# EAGLE design wifi_ring (EAGLE 9.6.1)
Wifi connection for RITTO 7630 (Intercom)
Assembly variants: Main
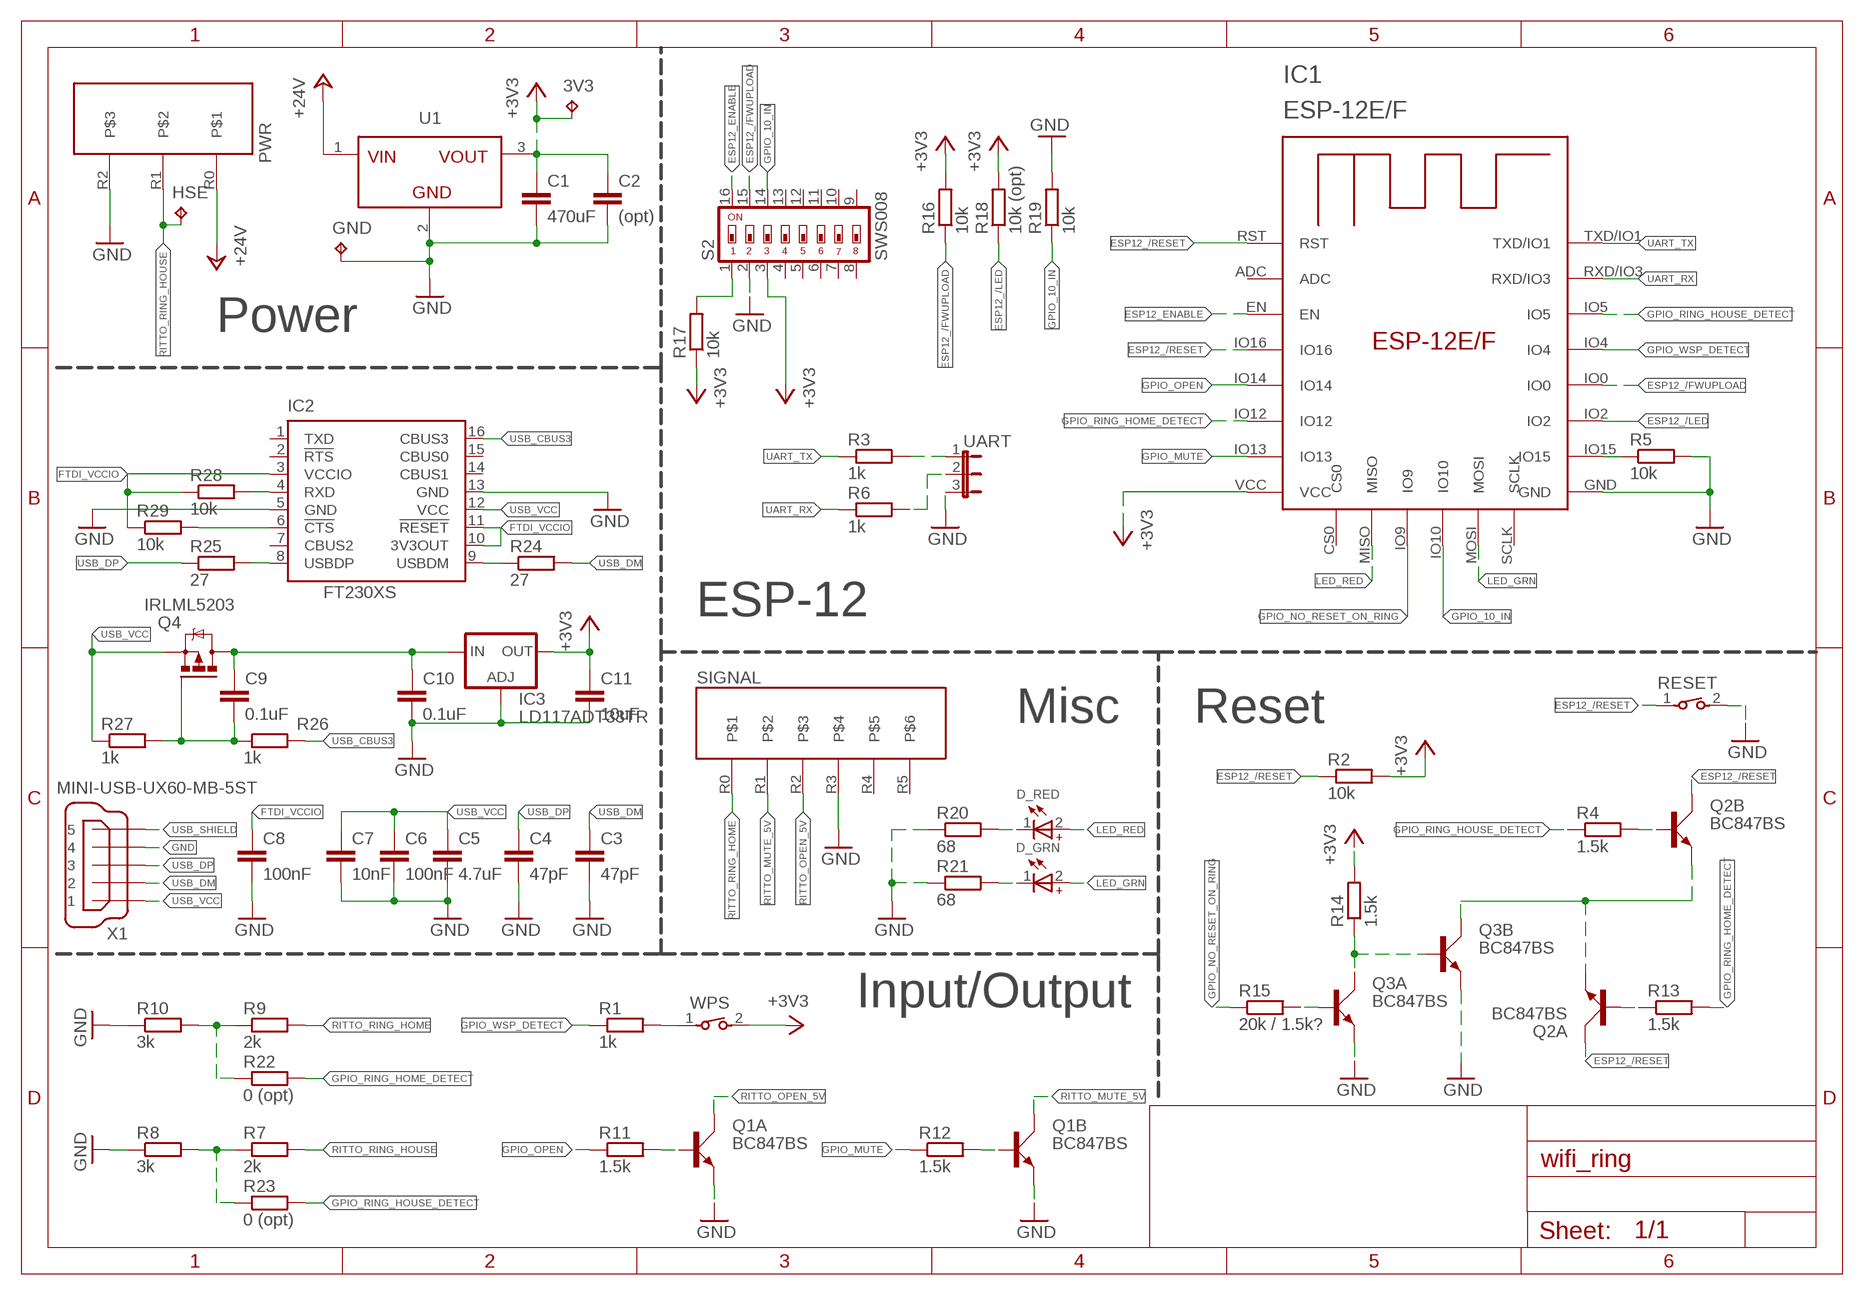
[diagram p0: schematic, sheet 1]

## Parts
3V3  TPTP10SQ  [TP10SQ]
C1  470uF  C-EUC1206  [C1206]
C2  (opt)  C-EUC1206  [C1206]
C3  47pF  C-EUC1206  [C1206]
C4  47pF  C-EUC1206  [C1206]
C5  4.7uF  C-EUC1206  [C1206]
C6  100nF  C-EUC1206  [C1206]
C7  10nF  C-EUC1206  [C1206]
C8  100nF  C-EUC1206  [C1206]
C9  0.1uF  C-EUC1206  [C1206]
C10  0.1uF  C-EUC1206  [C1206]
C11  10uF  C-EUC1206  [C1206]
D_GRN  WL-SMRW_1206_CYL_156120VS75300_NOR  [WL-SMRW_1206_CYL]
D_RED  WL-SMRW_1206_CYL_156120RS75300_NOR  [WL-SMRW_1206_CYL]
GND  TPTP10SQ  [TP10SQ]
HSE  TPTP10SQ  [TP10SQ]
IC1  ESP-12E/F  [ESP-12E]
IC2  FT230XS  [SSOP16]
IC3  LD117ADT33TR  [DPACK]
PWR  RAST_3  [RAST_3]
Q1  BC847BS  [SOT363_PHILIPS]
Q2  BC847BS  [SOT363_PHILIPS]
Q3  BC847BS  [SOT363_PHILIPS]
Q4  IRLML5203  [MICRO3]
R1  1k  R-EU_R1206  [R1206]
R2  10k  R-EU_R1206  [R1206]
R3  1k  R-EU_R1206  [R1206]
R4  1.5k  R-EU_R1206  [R1206]
R5  10k  R-EU_R1206  [R1206]
R6  1k  R-EU_R1206  [R1206]
R7  2k  R-EU_R1206  [R1206]
R8  3k  R-EU_R1206  [R1206]
R9  2k  R-EU_R1206  [R1206]
R10  3k  R-EU_R1206  [R1206]
R11  1.5k  R-EU_R1206  [R1206]
R12  1.5k  R-EU_R1206  [R1206]
R13  1.5k  R-EU_R1206  [R1206]
R14  1.5k  R-EU_R1206  [R1206]
R15  20k / 1.5k?  R-EU_R1206  [R1206]
R16  10k  R-EU_R1206  [R1206]
R17  10k  R-EU_R1206  [R1206]
R18  10k (opt)  R-EU_R1206  [R1206]
R19  10k  R-EU_R1206  [R1206]
R20  68  R-EU_R1206  [R1206]
R21  68  R-EU_R1206  [R1206]
R22  0 (opt)  R-EU_R1206  [R1206]
R23  0 (opt)  R-EU_R1206  [R1206]
R24  27  R-EU_R1206  [R1206]
R25  27  R-EU_R1206  [R1206]
R26  1k  R-EU_R1206  [R1206]
R27  1k  R-EU_R1206  [R1206]
R28  10k  R-EU_R1206  [R1206]
R29  10k  R-EU_R1206  [R1206]
RESET  434123025816  [434123025816]
S2  SWS008  [SMS-008]
SIGNAL  RAST_6  [RAST_6]
U1  MAGI³C-FDSM_SIP-3_173950378_17395XX78  [MAGI³C-FDSM_17395XX78]
UART  JP2E  [JP2]
WPS  434123025816  [434123025816]
X1  MINI-USB-UX60-MB-5ST  [UX60-MB-5ST]

## Nets
+3V3: 3V3.TP C1.1 C2.1 C11.1 IC1.VCC IC3.4(OUT) R2.2 R14.2 R16.2 R17.1 R18.2 S2.3 U1.3(VOUT) WPS.2
+24V: PWR.R0 U1.1(VIN)
ESP12_/FWUPLOAD: IC1.IO0 R16.1 S2.15
ESP12_/LED: IC1.IO2 R18.1
ESP12_/RESET: IC1.IO16 IC1.RST Q2.3(B:C) Q2.6(A:C) R2.1 RESET.1
ESP12_ENABLE: IC1.EN S2.16
FTDI_VCCIO: C8.1 IC2.3(VCCIO) IC2.10(3V3OUT) IC2.11(!RESET) R28.1 R29.1
GND: C1.2 C2.2 C3.2 C4.2 C5.2 C6.2 C7.2 C8.2 C10.2 C11.2 GND.TP IC1.GND IC2.5(GND) IC2.13(GND) IC3.1(ADJ) PWR.R2 Q1.1(A:E) Q1.4(B:E) Q3.1(A:E) Q3.4(B:E) R5.2 R8.1 R10.1 R19.2 R20.1 R21.1 RESET.2 S2.2 SIGNAL.R3 U1.2(GND) UART.3 X1.4
GPIO_10_IN: IC1.IO10 R19.1 S2.14
GPIO_MUTE: IC1.IO13 R12.1
GPIO_NO_RESET_ON_RING: IC1.IO9 R15.1
GPIO_OPEN: IC1.IO14 R11.1
GPIO_RING_HOME_DETECT: IC1.IO12 R13.2 R22.2
GPIO_RING_HOUSE_DETECT: IC1.IO5 R4.1 R23.2
GPIO_WSP_DETECT: IC1.IO4 R1.1
LED_GRN: D_GRN.2(+) IC1.MOSI
LED_RED: D_RED.2(+) IC1.MISO
N$1: R3.2 UART.1
N$2: R6.2 UART.2
N$3: IC1.IO15 R5.1
N$4: R1.2 WPS.1
N$5: R7.1 R8.2 R23.1
N$6: R9.1 R10.2 R22.1
N$7: R17.2 S2.1
N$8: Q2.5(B:B) R4.2
N$9: Q2.2(A:B) R13.1
N$10: Q1.2(A:B) R11.2
N$11: Q1.5(B:B) R12.2
N$12: D_RED.1(-) R20.2
N$13: D_GRN.1(-) R21.2
N$14: Q3.5(B:B) Q3.6(A:C) R14.1
N$15: Q3.2(A:B) R15.2
N$16: Q2.1(A:E) Q2.4(B:E) Q3.3(B:C)
N$17: IC2.9(USBDM) R24.1
N$18: C9.2 Q4.1(G) R26.1 R27.2
N$19: IC2.8(USBDP) R25.2
N$20: C9.1 C10.1 IC3.3(IN) Q4.3(D)
N$21: IC2.4(RXD) R28.2
N$22: IC2.6(!CTS) R29.2
RITTO_MUTE_5V: Q1.3(B:C) SIGNAL.R1
RITTO_OPEN_5V: Q1.6(A:C) SIGNAL.R2
RITTO_RING_HOME: R9.2 SIGNAL.R0
RITTO_RING_HOUSE: HSE.TP PWR.R1 R7.2
UART_RX: IC1.RXD/IO3 R6.1
UART_TX: IC1.TXD/IO1 R3.1
USB_CBUS3: IC2.16(CBUS3) R26.2
USB_DM: C3.1 R24.2 X1.2
USB_DP: C4.1 R25.1 X1.3
USB_SHIELD: X1.5
USB_VCC: C5.1 C6.1 C7.1 IC2.12(VCC) Q4.2(S) R27.1 X1.1
Unconnected: IC1.ADC IC1.CS0 IC1.SCLK IC2.1(TXD) IC2.2(!RTS) IC2.7(CBUS2) IC2.14(CBUS1) IC2.15(CBUS0) S2.4 S2.5 S2.6 S2.7 S2.8 S2.9 S2.10 S2.11 S2.12 S2.13 SIGNAL.R4 SIGNAL.R5

## Notes on the sheet
- Power
- ESP-12
- Misc | Reset
- Input/Output

## Library data of the parts
3V3 GND HSE = testpad:TP: Test pad
C1-C11 = rcl:C-EU: CAPACITOR, European symbol; SPICEPREFIX: C
D_GRN = 156120RS75300_Eagle_WL-SMRW_rev20b:WL-SMRW_1206_CYL: WL-SMRW SMD Mono-color Reverse mount Waterclear Characteristics Small size & thin body for space saving Ideal for narrow space applications Wide viewing angle Low power consumption Industry standard footprint Small LED package for exceptional brightness To emit light through a small cut-out hole in PCB Compatible with automatic placement machine Applications Front panels indicators LCD backlighting Keypad backlighting Push button backlighting Symbol and switch backlighting General LED lighting <https://www.we-online.com/catalog/media/o35733v209%20Family_WL-SMRW_neu.jpg> Details see: http://katalog.we-online.de/en/led/WL-SMRW?m Updated By Yingchun,Shan,2020-03-19 2020 (C) Wurth Elektronik; ABSTRAHLWINKEL: 140°; CHIP-TECHNOLOGY: AlInGaP; DATASHEET-URL: https://www.we-online.com/catalog/datasheet/156120VS75300.pdf; EMITTING-COLOR: Bright Green; I-V-TYP: 30mcd; LAMDA-DOM-TYP: 573nm; LAMDA-PEAK-TYP: 575nm; PART-NUMBER: 156120VS75300; V-F-TYP: 2V
D_RED = 156120RS75300_Eagle_WL-SMRW_rev20b:WL-SMRW_1206_CYL: WL-SMRW SMD Mono-color Reverse mount Waterclear Characteristics Small size & thin body for space saving Ideal for narrow space applications Wide viewing angle Low power consumption Industry standard footprint Small LED package for exceptional brightness To emit light through a small cut-out hole in PCB Compatible with automatic placement machine Applications Front panels indicators LCD backlighting Keypad backlighting Push button backlighting Symbol and switch backlighting General LED lighting <https://www.we-online.com/catalog/media/o35733v209%20Family_WL-SMRW_neu.jpg> Details see: http://katalog.we-online.de/en/led/WL-SMRW?m Updated By Yingchun,Shan,2020-03-19 2020 (C) Wurth Elektronik; ABSTRAHLWINKEL: 140°; CHIP-TECHNOLOGY: AlInGaP; DATASHEET-URL: https://www.we-online.com/catalog/datasheet/156120RS75300.pdf; EMITTING-COLOR: Red; I-V-TYP: 60mcd; LAMDA-DOM-TYP: 624nm; LAMDA-PEAK-TYP: 632nm; PART-NUMBER: 156120RS75300; V-F-TYP: 2V
IC1 = esp-12e-f:ESP-12E/F
IC2 = ftdichip:FT230X: USB to BASIC UART IC Auto generated by make-symbol-device-package-bsdl.ulp Rev. 43 Source: Data sheet <http://www.ftdichip.com/Support/Documents/DataSheets/ICs/DS_FT230X.pdf>
IC3 = v-reg:LD117A?*: Low drop fixed and adjustable positive voltage regulators 1 A Source: http://www.st.com/stonline/products/literature/ds/7194/ld1117axx.pdf
PWR = own_rast:RAST_3: RAST connector with 3 pins
Q1-Q3 = transistor-small-signal:BC847BS: NPN general purpose double transistor Source: http://www.farnell.com/datasheets/2466.pdf
Q4 = transistor-power:IRLML5203: HEXFET P-Channel Power MOSFET
R1-R29 = rcl:R-EU_: RESISTOR, European symbol; SPICEPREFIX: R
RESET WPS = 434123025816_Eagle_WS-TASV_rev20a:434123025816: WS-TASV J-Bend SMT Tact Switch 6.0x3.8 mm Material Properties Cover Material : Stainless Steel Properties Actuator Material:LCP Actuator Flammability :UL94 V-0 Rating Actuator Color:Black;White Frame Material: LCP Frame Flammability Rating :UL94 V-0 Frame Color: Black Contact Material :Stainless Steel Contact Plating: Silver Terminal Material: Copper Alloy Terminal Plating: Silver VR 12 V (DC) Contact Resistance Initial:100 mΩ Contact Resistance After Life Test: 1 Ω RISO:100 MΩ Withstanding Voltage:250 V (AC) Washable:No Qty.:3000 Mechanical Properties Stroke :0.25 mm General Information Operating Temperature:-40 up to +85 °C Washable:No Packaging Properties Packaging:Tape and Reel <https://www.we-online.com/catalog/media/o41273v209%20Family_WS-TASV_J-Bend_SMD_6.0x3.8_J-Bend_Tact_Switch_4341x30258x6.jpg> Details see: https://www.we-online.com/catalog/en/TASV_6_0X3_8_SMD_J-BEND/ Updated by yingchun,Shan;2020-02-20 2020(C) Würth Elektronik; DATASHEET-URL: https://www.we-online.com/catalog/datasheet/434123025816.pdf; H: 2.5mm; OPERATION-FORCE: 160g; PART-NUMBER: 434123025816; QTY: 3000
S2 = smd-special:SWS008: SMD Dip Switch 8 pol.
SIGNAL = own_rast:RAST_6: RAST connector with 6 pins
U1 = Wurth_Step Down Converter_MagI³C-FDSM:MAGI³C-FDSM_SIP-3: MagI³C-FDSM Fixed Step Down Regulator Module Characteristics Simplest design (no power supply knowledge required) Leaded through-hole package for easy manufacturing and prototyping Stand alone solution (CIN and COUT integrated, no external components) L78x series linear regulator replacement (no heatsink required) Low conducted and radiated EMI (compliant to EN55022 class B) Applications Point-of-Load from 24V, 18V, 15V, 12V, 9V rail Replacement for linear regulators Interface and microcontroller supply Industrial, Test & Measurement, Medical applications System power supplies <https://katalog.we-online.com/media/images/v2/o55808v209%20FDSM_MagI3C_173010378_4C.jpg> Details see: https://www.we-online.de/katalog/en/MAGIC_FDSM_FIXED_OUTPUT_VOLTAGE/ Updated by Ella Wu 2020-03-17 2020 (C) Würth Elektronik; DATASHEET-URL: https://www.we-online.de/katalog/datasheet/173950378.pdf; I-OUTPUT: 0.5A; MOUNT: THT; PART-NUMBER: 173950378; V-INPUT: 6-28V; V-OUTPUT: 3.3V
UART = jumper:JP2E: JUMPER
X1 = con-hirose:MINI-USB-: MINI USB Connector Source: http://www.hirose.co.jp/cataloge_hp/e24000019.pdf; OC_FARNELL: unknown; OC_NEWARK: unknown

## Board
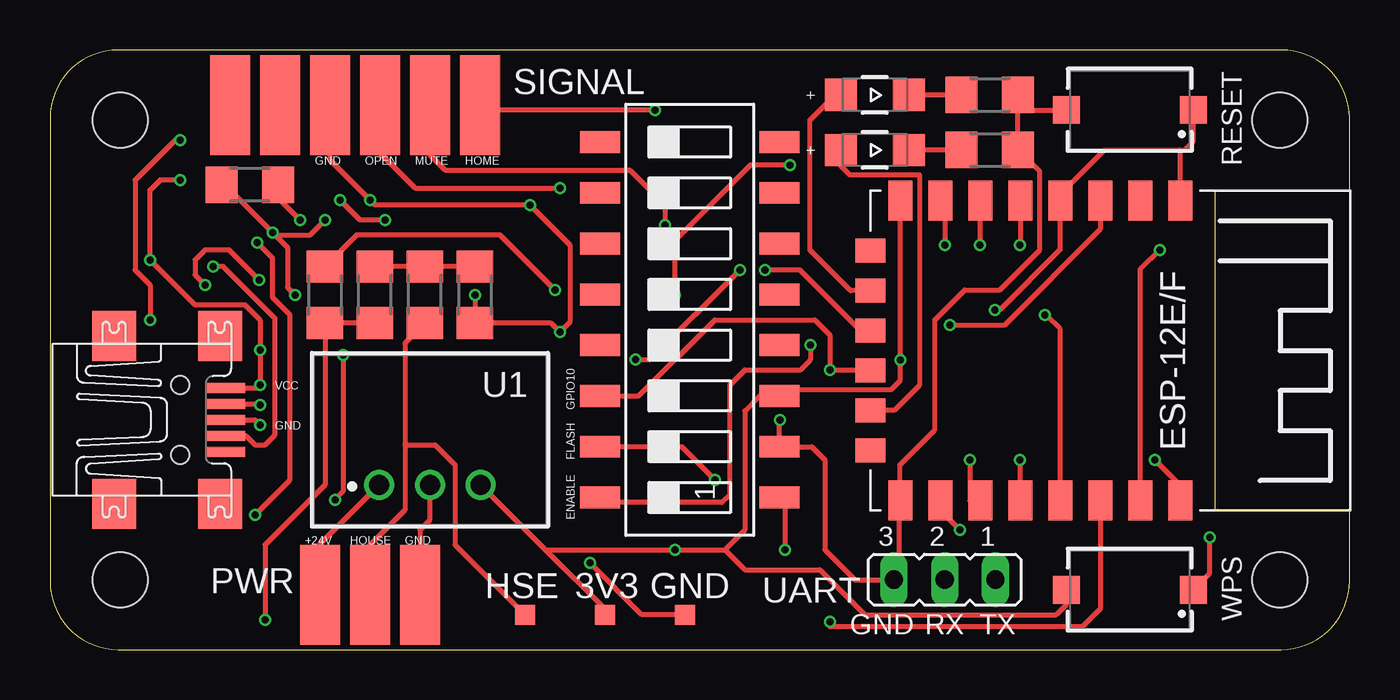
[diagram p1: board, top side]
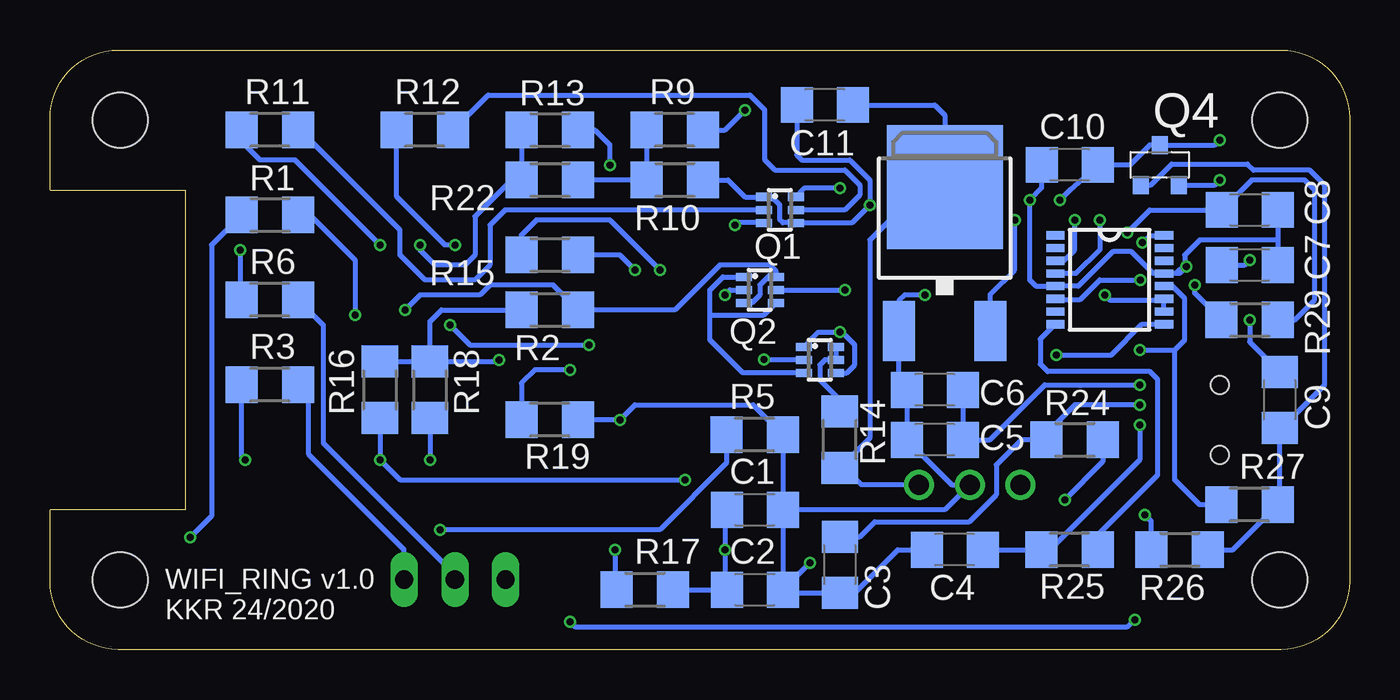
[diagram p2: board, bottom side, seen from below]

Size 65 x 30 mm. Coordinates in mm from the lower left corner, seen from the top.
Outline: 3.41,0 61.59,0 arc90 65,3.41 65,7 58.25,7 58.25,23 65,23 65,26.59 arc90 61.59,30 3.41,30 arc90 0,26.59 0,3.41 arc90 3.41,0
Copper layers (1*16): Top 0.018mm / dielectric 1.55mm / Bottom 0.018mm
Design rules "eC_2Layer_PClass6_BaseCopperO18_eCDefault": minimum track width 0.15mm, minimum drill 0.35mm, track to track 0.15mm, track to pad 0.15mm, pad to pad 0.15mm, via to via 0.15mm, smd to smd 0mil, copper to edge 0.25mm, drill to drill 0.35mm, minimum pad ring 0.175mm, minimum via ring 0.125mm, stop-mask expansion 0mil, vias tented up to drill 0.45mm, thermal gap 0.2mm
Holes 2.75 mm at 3.5,3.5 3.5,26.5 61.5,26.5 61.5,3.5

### Footprints (pad centres in the part's own frame; a part is rotated, then mirrored left to right if it is on the bottom)
TP10SQ = smd 1 x 1: TP 0,0
C1206 = smd 1.6 x 1.8: 1 -1.4,0; 2 1.4,0
WL-SMRW_1206_CYL = smd 1.6 x 1.6: 1 -1.7,0; 2 1.7,0
ESP-12E = smd 2 x 1.2: ADC -7.46,5.53; EN -7.46,3.53; GND 7.54,-6.47; IO0 7.54,-0.47; IO2 7.54,-2.47; IO4 7.54,1.53; IO5 7.54,3.53; IO12 -7.46,-2.47; IO13 -7.46,-4.47; IO14 -7.46,-0.47; IO15 7.54,-4.47; IO16 -7.46,1.53; RST -7.46,7.53; RXD/IO3 7.54,5.53; TXD/IO1 7.54,7.53; VCC -7.46,-6.47 | smd 1.2 x 1.5: CS0 -4.96,-7.97; IO9 -0.96,-7.97; IO10 1.04,-7.97; MISO -2.96,-7.97; MOSI 3.04,-7.97; SCLK 5.04,-7.97
SSOP16 = smd 0.914 x 0.406: 1 -2.718,2.223; 2 -2.718,1.587; 3 -2.718,0.953; 4 -2.718,0.318; 5 -2.718,-0.318; 6 -2.718,-0.953; 7 -2.718,-1.587; 8 -2.718,-2.223; 9 2.718,-2.223; 10 2.718,-1.587; 11 2.718,-0.953; 12 2.718,-0.318; 13 2.718,0.318; 14 2.718,0.953; 15 2.718,1.587; 16 2.718,2.223
DPACK = smd 1.6 x 3: 1 -2.28,-4.8; 3 2.28,-4.8 | smd 5.8 x 6.2: 4 0,2.38
RAST_3 = smd 2 x 5: R0 -2.5,0; R1 0,0; R2 2.5,0
SOT363_PHILIPS = smd 0.4 x 0.8: 1 -0.65,-0.8; 2 0,-0.8; 3 0.65,-0.8; 4 0.65,0.8; 5 0,0.8; 6 -0.65,0.8
MICRO3 = smd 0.8 x 0.9: 1 -0.95,-1; 2 0.95,-1; 3 0,1
R1206 = smd 1.6 x 1.803: 1 -1.422,0; 2 1.422,0
434123025816 = smd 1.35 x 1.4: 1 -3.175,0; 2 3.175,0
SMS-008 = smd 1.092 x 2.007: 1 -8.89,-4.496; 2 -6.35,-4.496; 3 -3.81,-4.496; 4 -1.27,-4.496; 5 1.27,-4.496; 6 3.81,-4.496; 7 6.35,-4.496; 8 8.89,-4.496; 9 8.89,4.496; 10 6.35,4.496; 11 3.81,4.496; 12 1.27,4.496; 13 -1.27,4.496; 14 -3.81,4.496; 15 -6.35,4.496; 16 -8.89,4.496
RAST_6 = smd 2 x 5: R0 -6,0; R1 -3.5,0; R2 -1,0; R3 1.5,0; R4 4,0; R5 6.5,0
MAGI³C-FDSM_17395XX78 = drill 1: 1 -2.54,0; 2 0,0; 3 2.54,0
JP2 = drill 0.914 long: 1 -2.54,0; 2 0,0; 3 2.54,0
UX60-MB-5ST = smd 2 x 0.5: 1 2.25,1.6; 2 2.25,0.8; 3 2.25,0; 4 2.25,-0.8; 5 2.25,-1.6 | smd 2.2 x 2.5: M1 -3.3,-4.2; M2 -3.3,4.2; M3 2,4.2; M4 2,-4.2 | hole 0.9: 0,-1.75; 0,1.75

### Placement (x,y rotation side)
3V3  27.75,1.75 0 top
C1  29.75,7 0 bottom
C2  29.75,3 0 bottom
C3  25.5,4.25 270 bottom
C4  19.75,5 180 bottom
C5  20.75,10.5 180 bottom
C6  20.75,13 180 bottom
C7  5,19.25 0 bottom
C8  5,22 0 bottom
C9  3.5,12.5 270 bottom
C10  14,24.25 180 bottom
C11  26.25,27.25 180 bottom
D_GRN  41.25,25 180 top
D_RED  41.25,27.75 180 top
GND  31.75,1.75 0 top
HSE  23.75,1.75 0 top
IC1  49,15 270 top
IC2  12,18.5 0 bottom
IC3  20.25,20.75 0 bottom
PWR  16,2.75 0 top
Q1  28.5,22 270 bottom
Q2  29.5,18 270 bottom
Q3  26.5,14.5 270 bottom
Q4  9.5,24.25 0 bottom
R1  54,21.75 180 bottom
R2  40,17 180 bottom
R3  54,13.25 0 bottom
R4  13.75,17.75 90 top
R5  29.75,10.75 0 bottom
R6  54,17.5 0 bottom
R7  18.75,17.75 270 top
R8  21.25,17.75 90 top
R9  33.75,26 0 bottom
R10  33.75,23.5 180 bottom
R11  54,26 0 bottom
R12  46.25,26 0 bottom
R13  40,26 180 bottom
R14  25.5,10.5 270 bottom
R15  40,19.75 180 bottom
R16  48.5,13 90 bottom
R17  35.25,3 180 bottom
R18  46,13 90 bottom
R19  40,11.5 0 bottom
R20  47,27.75 180 top
R21  47,25 180 top
R22  40,23.5 180 bottom
R23  16.25,17.75 270 top
R24  13.75,10.5 180 bottom
R25  14,5 0 bottom
R26  8.5,5 180 bottom
R27  5,7.25 0 bottom
R28  10,23.25 0 top
R29  5,16.5 180 bottom
RESET  54,27 180 top
S2  32,16.5 90 top
SIGNAL  15.5,27.25 180 top
U1  19,8.25 0 top
UART  44.75,3.5 180 top
WPS  54,3 180 top
X1  6.5,11.5 0 top

### Tracks (layer width: path | path; a pad name or v marks a point on that pad's centre or on a via)
+3V3  (via drill 0.35)
  Top 0.254: 33.75,5 34.75,6 34.75,11.94 35.5,12.69 S2.3 36.81,13 42.06,13 42.53,13.46 v42.53,14.5 IC1.VCC | U1.3 24.79,5 | 24.79,5 v31.25,5 33.75,5 | 33.75,5 34.75,4 38.5,4 40.75,1.75 50.33,1.75 50.83,2.25 WPS.2 | 3V3.TP 27.75,2.04 24.79,5
  Bottom 0.254: R16.2 R18.2 | R18.2 42.61,14.42 v42.53,14.5 | U1.3 24.42,8.25 25.25,9.08 R14.2 24,10.58 24,20.5 21.37,23.13 IC3.4 20.25,26.75 20.75,27.25 C11.1 | R18.2 46,16.42 45.42,17 R2.2 | R17.1 31.25,3 | 31.25,3 C2.1 | C1.1 31.25,6.9 v31.25,5 31.25,3
+24V
  Top 0.254: U1.1 13.5,5.29 PWR.R0
ESP12_/FWUPLOAD  (via drill 0.35)
  Top 0.254: v48.5,9.5 48.5,7.46 IC1.IO0 | v33.25,8.5 31.6,10.15 S2.15
  Bottom 0.254: R16.1 v48.5,9.5 47.5,8.5 v33.25,8.5
ESP12_/LED  (via drill 0.35)
  Top 0.254: IC1.IO2 46,7.46 v46,9.5
  Bottom 0.254: R18.1 v46,9.5
ESP12_/RESET  (via drill 0.35)
  Top 0.254: v47.25,17 47.5,17 50.53,20.03 IC1.IO16 50.53,22.78 52.72,24.97 56.53,24.97 | RESET.1 57.17,25.43 56.75,25 56.5,25 56.53,24.97 | IC1.RST 56.53,24.97
  Bottom 0.254: Q2.3 29.9,17.35 29.5,17.75 29.5,18.25 29.1,18.65 Q2.6 28.7,18.95 29,19.25 31.5,19.25 33.75,17 R2.1 39.83,18.25 43,18.25 43.5,17.75 46.5,17.75 v47.25,17
ESP12_ENABLE  (via drill 0.35)
  Top 0.254: IC1.EN 52.53,21.03 47.75,16.25 v45,16.25 | S2.16 27.75,7.36 33.61,7.36 34,7.75 34,13.25 34.75,14 37.53,14 38.03,14.5 v38.03,15.25
  Bottom 0.254: v45,16.25 44,15.25 v38.03,15.25
FTDI_VCCIO  (via drill 0.35)
  Top 0.254: v11.12,20.88 11.88,20.12 11.88,18.12 v12.25,17.75 | v11.12,20.88 11.25,20.75 13,20.75 v13.75,21.5 | R28.1 8.75,23.25 v11.12,20.88
  Bottom 0.254: v11.12,20.88 10,22 C8.1 4.9,23.5 2.25,23.5 1.75,23 1.75,17.5 2.75,16.5 R29.1 | IC2.10 IC2.11 9.33,17.5 12,17.5 v12.25,17.75 | IC2.3 14.3,19.45 13.75,20 v13.75,21.5
GND  (via drill 0.35)
  Top 0.254: PWR.R2 18.5,6 19,6.5 U1.2 | v36.5,11.5 S2.2 38.1,10.15 38.75,9.5 38.75,5 40.25,3.5 UART.3 42.49,3.78 42.49,7.5 IC1.GND 42.5,7.49 42.5,9.25 44.25,11 44.25,16.5 45.75,18 47.5,18 49.5,20 49.5,23.92 R21.1 R20.1 49.17,27 RESET.2 | SIGNAL.R3 14,24.5 v16,22.5 16.25,22.25 v24,22.25 26,20.25 26,16.38 v25.5,15.88 25.05,16.33 R8.1 v21.25,17.75 | GND.TP 29.59,1.75 v27,4.34 | X1.4 9.8,10.7 10.25,10.25 10.75,10.25 11.25,10.75 11.25,16.57 8.66,19.17 v8.16,19.17
  Bottom 0.254: R19.2 v36.5,11.5 35.75,12.25 29.83,12.25 R5.2 28.33,7.02 C1.2 | R10.1 31.08,23.5 30.23,22.65 Q1.1 28.9,22.65 28.5,22.25 28.5,21.5 28.35,21.35 Q1.4 27.68,21.38 24.88,21.38 v24,22.25 24,23.5 25,24.5 27.4,24.5 27.65,24.75 C11.2 | Q3.1 26.57,15.88 v25.5,15.88 25.38,15.88 24.75,15.25 24.75,14.25 25.15,13.85 Q3.4 | C4.2 22.6,5 24.75,2.85 C3.2 28.2,2.85 C2.2 | C8.2 3.6,20.5 | 3.6,20.5 C7.2 | IC2.13 9.82,18.82 10.91,19.91 11.84,19.91 13.57,18.18 IC2.5 15.68,18.18 16,18.5 v16,22.5 15.4,23.1 C10.2 | v21.25,17.75 22.25,17.75 22.53,17.47 IC3.1 22.53,13.38 C6.2 C5.2 19.9,8.25 U1.2 20.25,7 C1.2 | IC2.13 8.68,18.82 8.25,19.25 8.25,19.75 7.5,20.5 3.6,20.5 | v8.16,19.17 8.51,18.82 IC2.13 | C1.2 C2.2 | C2.2 v27,4.34
GPIO_10_IN  (via drill 0.35)
  Top 0.254: IC1.IO10 41.03,14 v39,14 39,15.75 38.25,16.5 33.25,16.5 29.44,12.69 S2.14
  Bottom 0.254: v39,14 40.75,14 41.42,13.33 R19.1
GPIO_MUTE  (via drill 0.35)
  Top 0.254: IC1.IO13 44.75,22.24 v44.75,20.25
  Bottom 0.254: v44.75,20.25 45.25,20.25 47.67,22.67 R12.1
GPIO_NO_RESET_ON_RING  (via drill 0.35)
  Top 0.254: IC1.IO9 40.54,15.96 37.5,19 v35.75,19
  Bottom 0.254: v35.75,19 36.5,19.75 R15.1
GPIO_OPEN  (via drill 0.35)
  Top 0.254: v48.5,20.25 48.53,20.28 IC1.IO14
  Bottom 0.254: v48.5,20.25 52.75,24.5 54.5,24.5 55.42,25.42 R11.1
GPIO_RING_HOME_DETECT  (via drill 0.35)
  Top 0.254: IC1.IO12 46.5,22.43 v46.5,20.25
  Bottom 0.254: R13.2 R22.2 41.92,23.5 43.75,21.67 43.75,19.75 44.25,19.25 45.75,19.25 46.5,20 v46.5,20.25
GPIO_RING_HOUSE_DETECT  (via drill 0.35)
  Top 0.254: IC1.IO5 52.53,2.03 51.64,1.14 39,1.14 v39,1.39 | v10.75,1.5 10.75,5.25 13.75,8.25 R4.1 R23.2
  Bottom 0.254: v39,1.39 38.75,1.14 11.11,1.14 v10.75,1.5
GPIO_WSP_DETECT  (via drill 0.35)
  Top 0.254: IC1.IO4 | IC1.IO4 50.53,16.03 49.81,16.75 v49.75,16.75
  Bottom 0.254: R1.1 52,21.75 49.75,19.5 v49.75,16.75
LED_GRN
  Top 0.254: IC1.MOSI 41.07,12 42.25,12 43.5,13.25 43.5,23.75 40,23.75 39.55,24.2 D_GRN.2
LED_RED
  Top 0.254: IC1.MISO 40.04,17.96 38,20 38,26.5 39.25,27.75 D_RED.2
N$1
  Bottom 0.254: UART.1 47.29,5 52.08,9.79 52.08,12.75 R3.2
N$2
  Bottom 0.254: UART.2 44.75,3.75 51.33,10.33 51.33,16.25 R6.2
N$3  (via drill 0.35)
  Top 0.254: IC1.IO15 44.53,6.97 v45.5,6
  Bottom 0.254: R5.1 31.17,9.33 34.5,6 v45.5,6
N$4  (via drill 0.35)
  Top 0.254: WPS.1 58,3.83 v58,5.61
  Bottom 0.254: R1.2 56.92,20.25 56.92,6.68 v58,5.61
N$5
  Top 0.254: R23.1 R7.1 R8.2
N$6
  Bottom 0.254: R9.1 R10.2 R22.1
N$7  (via drill 0.35)
  Top 0.254: S2.1 36.75,7.36 v36.75,5
  Bottom 0.254: v36.75,5 36.75,3.08 R17.2
N$8  (via drill 0.35)
  Top 0.254: v25.25,18 22.5,20.75 15.33,20.75 R4.2
  Bottom 0.254: Q2.5 v25.25,18
N$9  (via drill 0.35)
  Top 0.254: v31.25,17.74 31.25,20.46 35.04,24.25 v37,24.25
  Bottom 0.254: v31.25,17.74 30.99,18 Q2.2 | R13.1 37.75,26 37,25.25 v37,24.25
N$10
  Bottom 0.254: Q1.2 42.25,22 43,21.25 43,19.25 43.75,18.5 46.25,18.5 47.5,19.75 47.5,21 52.5,26 R11.2
N$11
  Bottom 0.254: R12.2 43.08,27.75 30,27.75 29.25,27 29.25,24.5 28.75,24 25.25,24 24.5,23.25 24.5,22.75 25.25,22 Q1.5
N$12
  Top 0.254: R20.2 D_RED.1
N$13
  Top 0.254: R21.2 D_GRN.1
N$14
  Bottom 0.254: Q3.6 Q3.5 26.25,14.5 26.5,14.25 26.5,13.5 25.5,12.5 R14.1
N$15  (via drill 0.35)
  Top 0.254: v29.29,14.51 30.01,14.51 v34.5,19
  Bottom 0.254: v34.5,19 37,21.5 40.67,21.5 41.42,20.75 R15.2 | v29.29,14.51 v29.28,14.5 Q3.2
N$16
  Bottom 0.254: Q2.1 31.35,18.65 32,18 32,16.75 | 32,16.75 29.3,16.75 Q2.4 | Q3.3 30.35,13.85 32,15.5 32,16.75
N$17  (via drill 0.35)
  Top 0.254: v14.25,7.5 14.66,7.91 v14.66,14.75
  Bottom 0.254: R24.1 12.33,9.42 v14.25,7.5 | v14.66,14.75 11.91,14.75 10.38,16.28 IC2.9
N$18
  Bottom 0.254: R26.1 5.83,5 R27.2 3.5,7.33 3.5,11 | Q4.1 9.95,23.25 8.9,24.3 5.11,24.3 4.79,23.98 1.98,23.98 1.25,23.25 1.25,13.25 3.5,11 | 3.5,11 C9.2
N$19
  Bottom 0.254: R25.2 12.58,5.74 9.59,8.73 9.59,13.52 9.98,13.91 15.1,13.91 15.47,14.28 15.47,15.53 IC2.8
N$20  (via drill 0.35)
  Top 0.254: v16.75,21.5 15.5,21.5 v14.5,22.5 | v5,16.5 5,18.25 4.25,19 4.25,23.5 6.25,25.5 v6.5,25.5
  Bottom 0.254: IC3.3 17.97,17.78 16.75,19 v16.75,21.5 | v14.5,22.5 14,23 C10.1 11,24.25 10,25.25 Q4.3 6.75,25.25 v6.5,25.5 | C9.1 5,15.4 v5,16.5
N$21  (via drill 0.35)
  Top 0.254: v12.5,21.5 11.42,22.58 R28.2
  Bottom 0.254: v12.5,21.5 12.5,20 13.68,18.82 IC2.4
N$22  (via drill 0.35)
  Top 0.254: v10.47,18.5 8.97,20 7.75,20 7.25,19.5 7.25,18.75 v7.75,18.25
  Bottom 0.254: IC2.6 14.67,17.5 13.5,17.5 12.5,18.5 v10.47,18.5 | R29.2 7.75,17.83 v7.75,18.25
RITTO_MUTE_5V  (via drill 0.35)
  Top 0.254: SIGNAL.R1 19,24.75 19.75,24 29,24 30.75,22.25 v30.75,21.25
  Bottom 0.254: Q1.3 30.65,21.35 v30.75,21.25
RITTO_OPEN_5V  (via drill 0.35)
  Top 0.254: v25.5,23.09 18.25,23.09 16.5,24.84 SIGNAL.R2
  Bottom 0.254: v25.5,23.09 27.26,23.09 Q1.6
RITTO_RING_HOME  (via drill 0.35)
  Top 0.254: v30.25,27 21.75,27 SIGNAL.R0
  Bottom 0.254: R9.2 31.25,26 v30.25,27
RITTO_RING_HOUSE
  Top 0.254: PWR.R1 16,5.25 17.75,7 17.75,10.25 | 17.75,10.25 17.75,15.33 R7.2 | HSE.TP 20.25,5.25 20.25,9.25 19.25,10.25 17.75,10.25
UART_RX  (via drill 0.35)
  Top 0.254: v55.5,20 54.53,19.03 IC1.RXD/IO3
  Bottom 0.254: v55.5,20 55.5,17.58 R6.1
UART_TX  (via drill 0.35)
  Top 0.254: IC1.TXD/IO1 56.5,7.49 56.5,8.25 v55.25,9.5
  Bottom 0.254: v55.25,9.5 55.42,9.67 R3.1
USB_CBUS3  (via drill 0.35)
  Top 0.254: v10.25,6.75 12,8.5 12,16.75 11.12,17.62 11.12,19.59 v10.36,20.36
  Bottom 0.254: R26.2 9.92,6.42 v10.25,6.75 | v10.36,20.36 9.99,20.72 IC2.16
USB_DM  (via drill 0.35)
  Top 0.254: X1.2 10.45,12.3 v10.5,12.25
  Bottom 0.254: R24.2 15.5,10.5 | 15.5,10.5 16.42,10.5 17.67,9.25 17.67,7.75 19.02,6.4 23.75,6.4 24.5,5.65 C3.1 | v10.5,12.25 13.75,12.25 15.5,10.5
USB_DP  (via drill 0.35)
  Top 0.254: X1.3 10.25,11.5 v10.5,11.25
  Bottom 0.254: C4.1 R25.1 15,5 10.5,9.5 v10.5,11.25
USB_VCC  (via drill 0.35)
  Top 0.254: X1.1 10.35,13.1 v10.5,13.25 v10.5,15 10.5,16.5 9.75,17.25 7.25,17.25 v5,19.5 5,23 5.5,23.5 v6.5,23.5
  Bottom 0.254: C6.1 C5.1 18,10.5 15.25,13.25 v10.5,13.25 | R27.1 7.5,7.25 8.75,8.5 8.75,15 | v10.5,15 8.75,15 | Q4.2 6.75,23.25 v6.5,23.5 | C7.1 5.25,19.25 v5,19.5 | 8.75,15 8.25,15.5 8.25,17.57 8.86,18.18 IC2.12

### Text on the board
tNames: GND | OPEN | MUTE | HOME | VCC | GPIO10 | GND | FLASH | ENABLE | +24V | HOUSE | GND | GND | RX | TX
bNames: WIFI_RING v1.0 / KKR 24/2020